# EasyEDA Pro project 工创扩展板.eprj

# Schematic Schematic1
Board Name: Board1; Create Date: 2025-02-10; Page Name: GPIO扩展功能; Project Name: 工创扩展板; Schematic Name: Schematic1; Update Date: 2025-02-24; Company: 嘉立创EDA; Page Size: A4; Version: V1.0
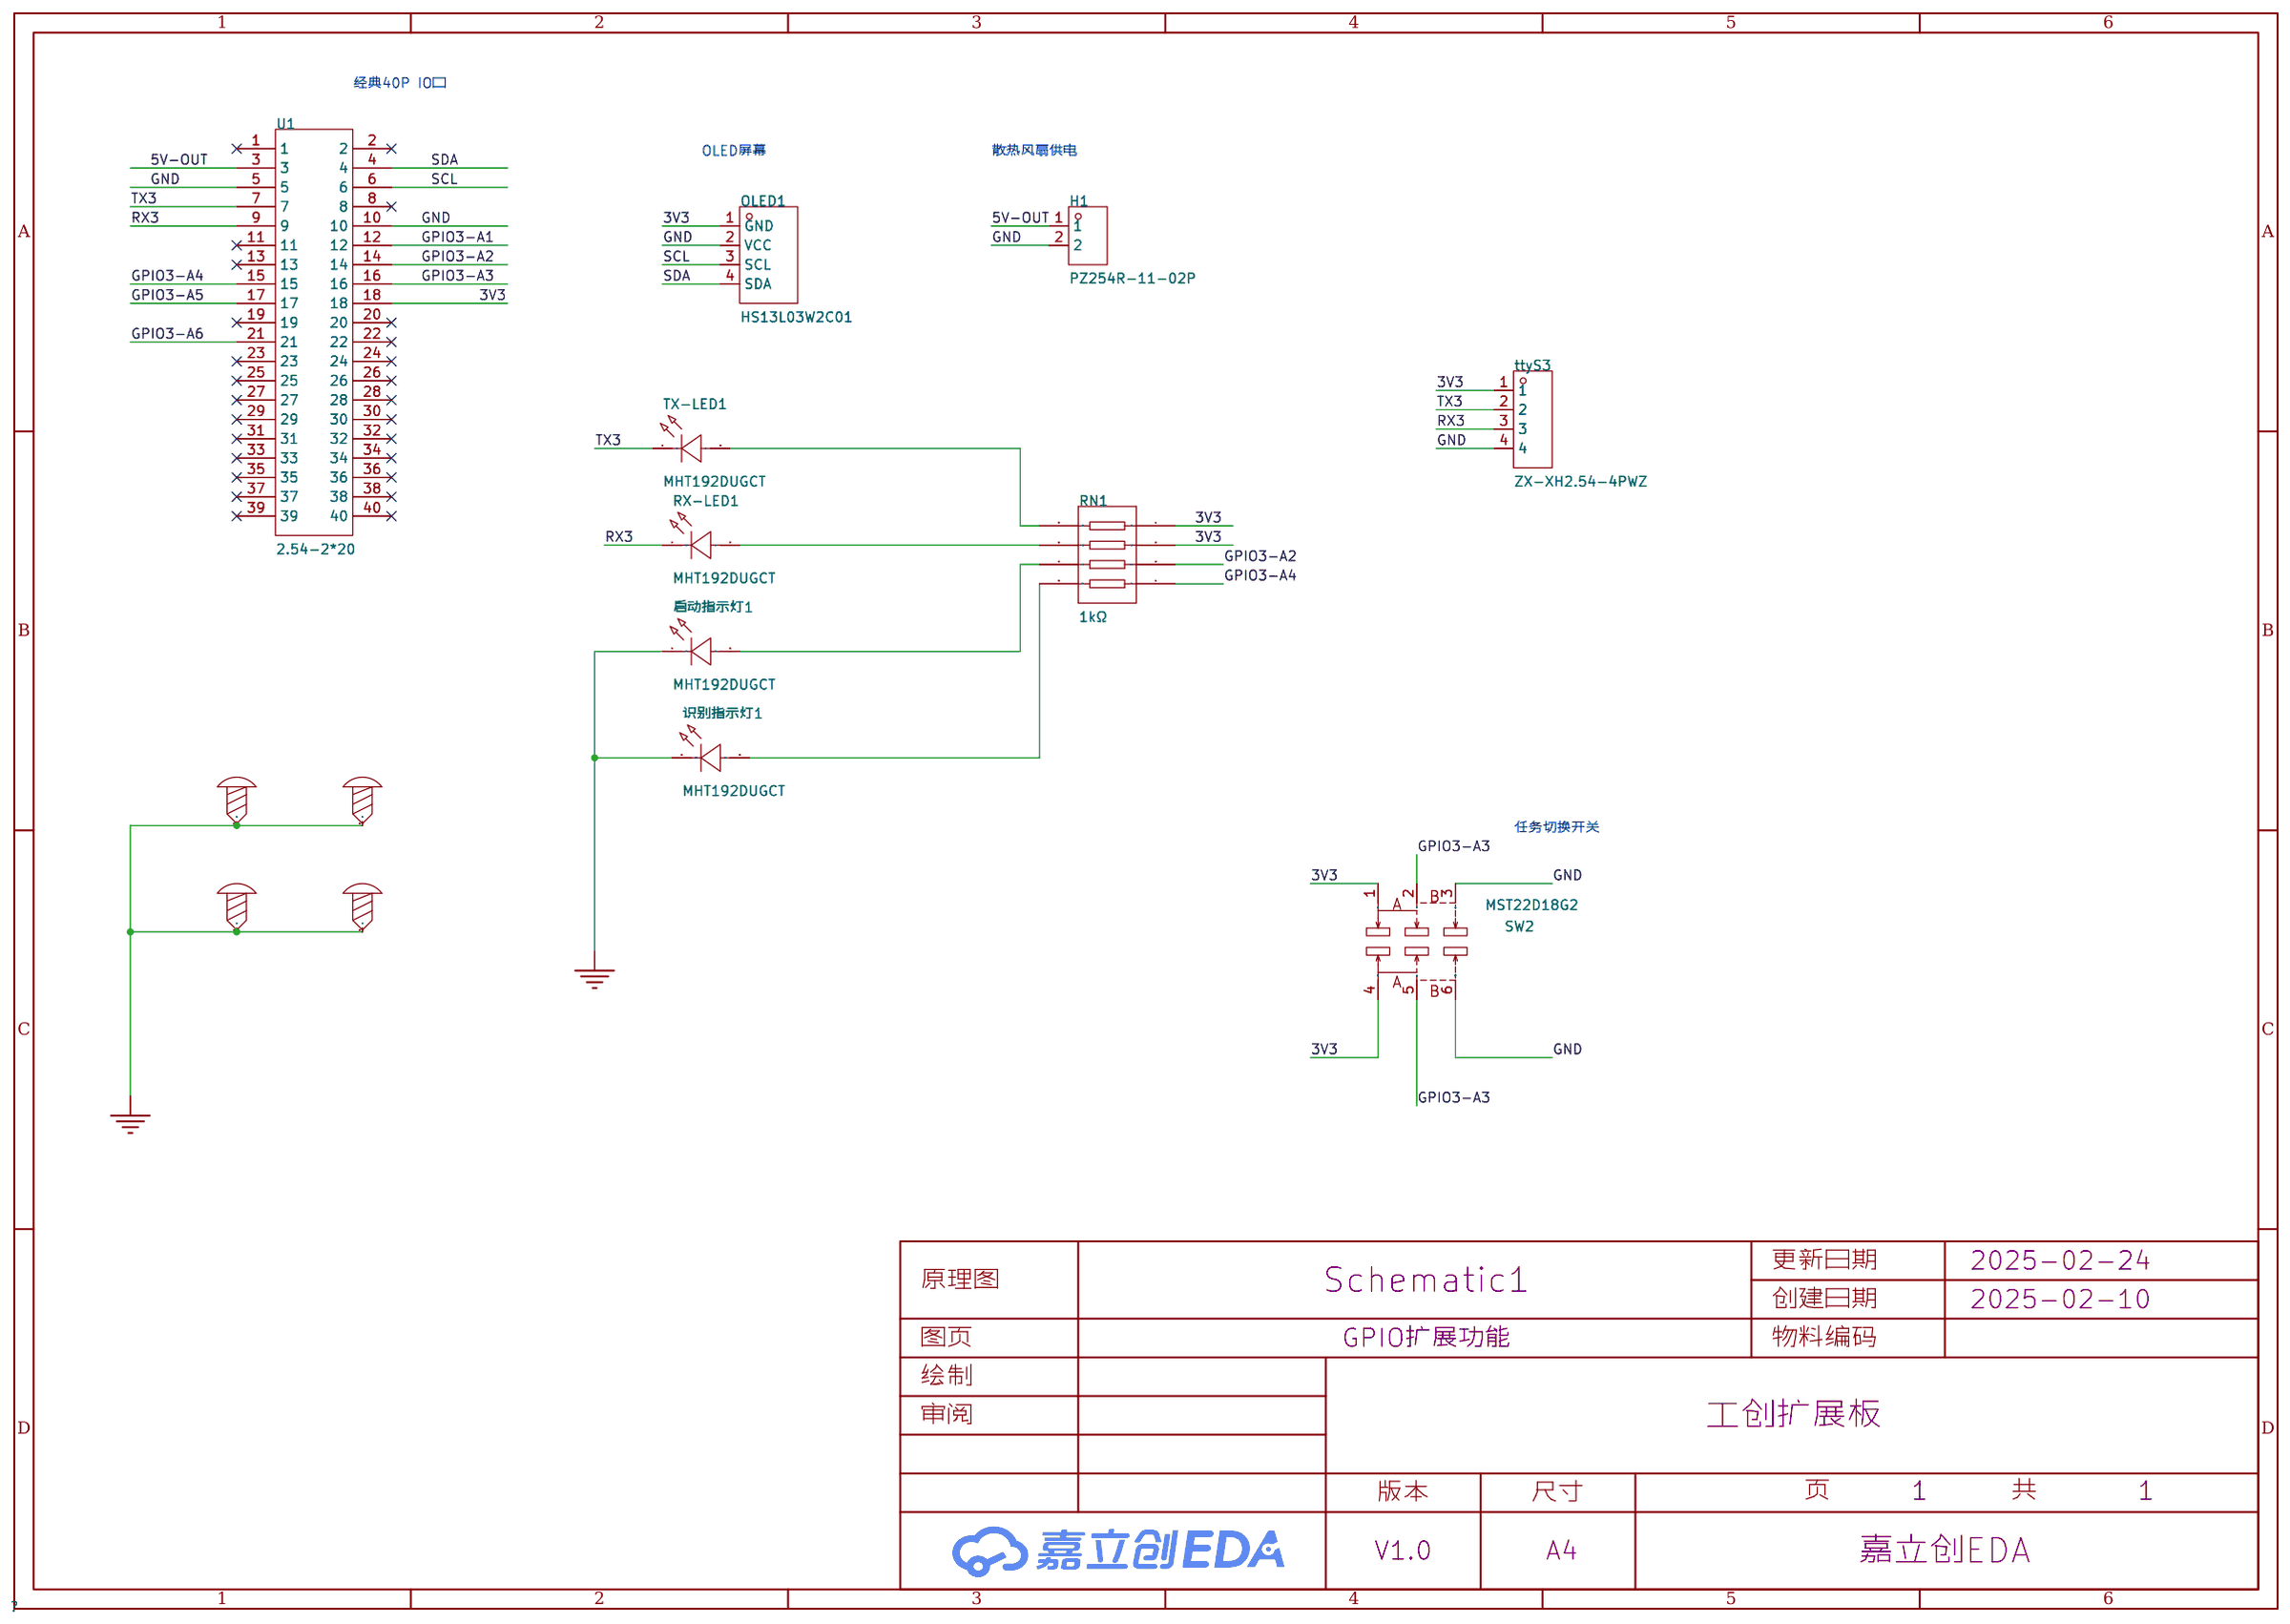
[diagram p0: schematic sheet]

## Parts
H1  PZ254R-11-02P  [HDR-TH_2P-P2.54-H-M-W10.4]
OLED1  HS13L03W2C01  [OLED-TH_L35.4-W33.5_HS13L03W2C01]
RN1  1kΩ  [RES-ARRAY-SMD_0603-8P-L3.2-W1.6-BL]
RX-LED1  MHT192DUGCT  [LED0603-RD]
SCREW1  -  [M3螺丝]
SCREW2  -  [M3螺丝]
SCREW3  -  [M3螺丝]
SCREW4  -  [M3螺丝]
SW2  MST22D18G2  [SW-SMD_MST22D18G2]
ttyS3  ZX-XH2.54-4PWZ  [CONN-TH_4P-P2.50_ZX-XH2.54-4PWZ]
TX-LED1  MHT192DUGCT  [LED0603-RD]
U1  2.54-2*20  [HDR-TH_40P-P2.54-V-F-R2-C20-S2.54]
启动指示灯1  MHT192DUGCT  [LED0603-RD]
识别指示灯1  MHT192DUGCT  [LED0603-RD]

## Library data of the parts
H1 = PZ254R-11-02P: LCSC Part Name: 间距:2.54mm 1x2P 弯插 方针; Supplier Part: C492410; Manufacturer: XFCN(兴飞); Supplier Footprint: 弯插,P=2.54mm; JLCPCB Part Class: 扩展库; Datasheet: https://atta.szlcsc.com/upload/public/pdf/source/20200309/C492410_AD20A982E51A4870F6FD4D2413672598.pdf; Supplier: LCSC; Pin Structure: 1x2P; Pitch: 2.54mm; Circluar Pins/Square Pins: 方针; Mounting Type: 弯插; Number of Rows: 单排; Number of Pins: 2P; Length of Mating Pin: 6mm; Insulation Height: 2.5mm; Contact Material: 黄铜; Operating Temperature Range: -40℃~+105℃; Color: 黑色
OLED1 = HS13L03W2C01: LCSC Part Name: 1.3'1.3寸 128*64 OLED显示屏 I2C通讯 SH1106 白光; Supplier Part: C7465997; Manufacturer: HS(汉昇); JLCPCB Part Class: 扩展库; Datasheet: https://atta.szlcsc.com/upload/public/pdf/source/20230720/8731A47396DED074CDCD72E9ACEFB46F.pdf; Supplier: LCSC; Main Control Chip: SH1106; Interface Type: I2C; Size: 1.3; Operating Temperature: -40℃~+70℃
RN1 = YC164-FR-071KL: LCSC Part Name: 1kΩ ±1%; Supplier Part: C110021; Manufacturer: YAGEO(国巨); Supplier Footprint: 0603x4; JLCPCB Part Class: 扩展库; Datasheet: https://atta.szlcsc.com/upload/public/pdf/source/20170428/1493376791474.pdf; Supplier: LCSC; Number of Resistors: 4; Tolerance: ±1%; Power(Watts): 62.5mW; Temperature Coefficient: ±200ppm/℃; Number of Pins: 8
RX-LED1 TX-LED1 启动指示灯1 识别指示灯1 = MHT192DUGCT: LCSC Part Name: 0603正贴翠绿色光0.6T; Supplier Part: C7470862; Manufacturer: MEIHUA(美华); Supplier Footprint: 0603; JLCPCB Part Class: 扩展库; Datasheet: https://atta.szlcsc.com/upload/public/pdf/source/20231114/40E469906A7C8BE4964C1CB3B5553F65.pdf; Supplier: LCSC; Emitted Color: 翠绿色; Forward Voltage (VF): 2.3V~2.8V; Forward Current: 5mA; Dominant Wavelength: 515nm~530nm; Peak Wavelength: 518nm; Lens Color: 透明透镜; Luminous Intensity: 285mcd~565mcd; Viewing Angle: 120°; Operating Temperature: -40℃~+85℃
SCREW1-SCREW4 = M3螺丝: Supplier Footprint: 插件
SW2 = MST22D18G2: LCSC Part Name: 两档立式贴片 6脚拨动 柄长2.0MM; Supplier Part: C431544; Manufacturer: SHOU HAN(首韩); Supplier Footprint: SMD,3.6x9.1mm; JLCPCB Part Class: 扩展库; Datasheet: https://atta.szlcsc.com/upload/public/pdf/source/20190925/C431544_D32DFFD935A96A6C5145903882D4ABA1.pdf; Supplier: LCSC; Circuit: 双刀双掷; Pin Style: SMD接片; Switch Length: 9.1mm; Switch Width: 3.6mm; Switch Height: 3.45mm; Mounting Style: 立贴; Current Rating (DC): 50mA; Voltage Rating (DC): 12V; Mechanical Life: 1万次; Operating Temperature: -30℃~+80℃
ttyS3 = ZX-XH2.54-4PWZ: LCSC Part Name: 1x4P 间距:2.5mm 弯插 系列:XH; Supplier Part: C7429643; Manufacturer: Megastar(兆星); Supplier Footprint: 弯插,P=2.5mm; JLCPCB Part Class: 扩展库; Datasheet: https://atta.szlcsc.com/upload/public/pdf/source/20230619/8DC602C7BA46C153FF1BE89D90453879.pdf; Supplier: LCSC; Pins Structure: 1x4P; Pitch: 2.5mm; Mounting Type: 弯插; Reference Series: XH; Number of Pins: 4P; Number of Rows: 1; Number of PINs Per Row: 4; Rated Current: 3A; Contact Material: 黄铜; Contact Plating: 锡; Operating Temperature: -25℃~+85℃; Rated Voltage (Max): 250V; Plastic Material: PA66; Flame Retardant Rating: UL94V-0; Color: 白色; Z-Height of the Board: 5.9mm; X-Length of Bottom Edge on Board (Spacing Line): 12.5mm; Y-Width of Bottom Edge on Board: 7.32mm
U1 = 2.54-2*20: LCSC Part Name: 间距:2.54mm 2x20P 直插; Supplier Part: C2977589; Manufacturer: ZHOURI(洲日); Supplier Footprint: 插件,P=2.54mm; JLCPCB Part Class: 扩展库; Datasheet: https://atta.szlcsc.com/upload/public/pdf/source/20220328/834E302BE3C038BBC5C70F5E02589B1E.pdf; Supplier: LCSC; Holes Structure: 2x20P; Pitch: 2.54mm; Row Spacing: 2.54mm; Circular Hole / Square Hole: 方孔; Mounting Type: 直插; Number of Rows: 双排; Number of Holes: 40P; Current Rating (Max): 2.5A; Holes Direction: 顶部; Insulation Height: 8.5mm; Operating Temperature Range: -40℃~+105℃

## Nets
3V3: OLED1.1(GND) RN1.3 RN1.4 SW2.1 SW2.4 ttyS3.1 U1.18
5V-OUT: H1.1 U1.3
GND: H1.2 OLED1.2(VCC) SCREW1.1 SCREW2.1 SCREW3.1 SCREW4.1 SW2.3 SW2.6 ttyS3.4 U1.5 U1.10 启动指示灯1.1(K) 识别指示灯1.1(K)
GPIO3-A1: U1.12
GPIO3-A2: RN1.2 U1.14
GPIO3-A3: SW2.2 SW2.5 U1.16
GPIO3-A4: RN1.1 U1.15
GPIO3-A5: U1.17
GPIO3-A6: U1.21
RX3: RX-LED1.1(K) ttyS3.3 U1.9
SCL: OLED1.3(SCL) U1.6
SDA: OLED1.4(SDA) U1.4
TX3: ttyS3.2 TX-LED1.1(K) U1.7
Net-(RN1-5): RN1.5 TX-LED1.2(A)
Net-(RN1-6): RN1.6 RX-LED1.2(A)
Net-(RN1-7): RN1.7 启动指示灯1.2(A)
Net-(RN1-8): RN1.8 识别指示灯1.2(A)

Not connected (* = marked no-connect by the designer): U1 1* 2* 8* 11* 13* 19* 20* 22* 23* 24* 25* 26* 27* 28* 29* 30* 31* 32* 33* 34* 35* 36* 37* 38* 39* 40*

## Notes on the sheet
- 经典40P IO口
- OLED屏幕
- 散热风扇供电
- 任务切换开关

# Board PCB1
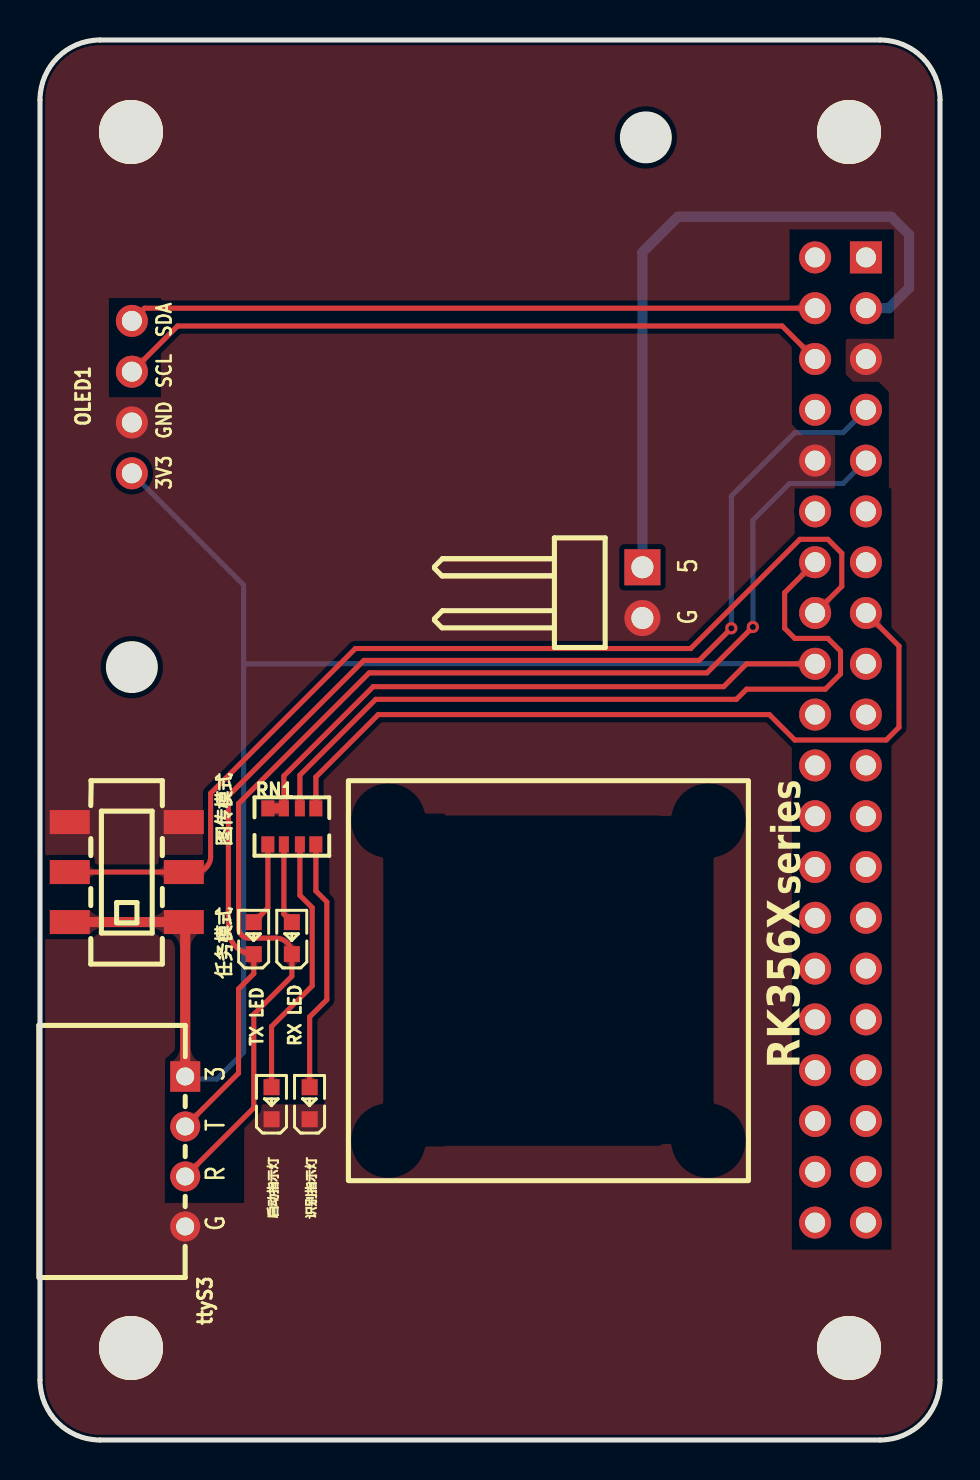
[diagram p1: board, top side]
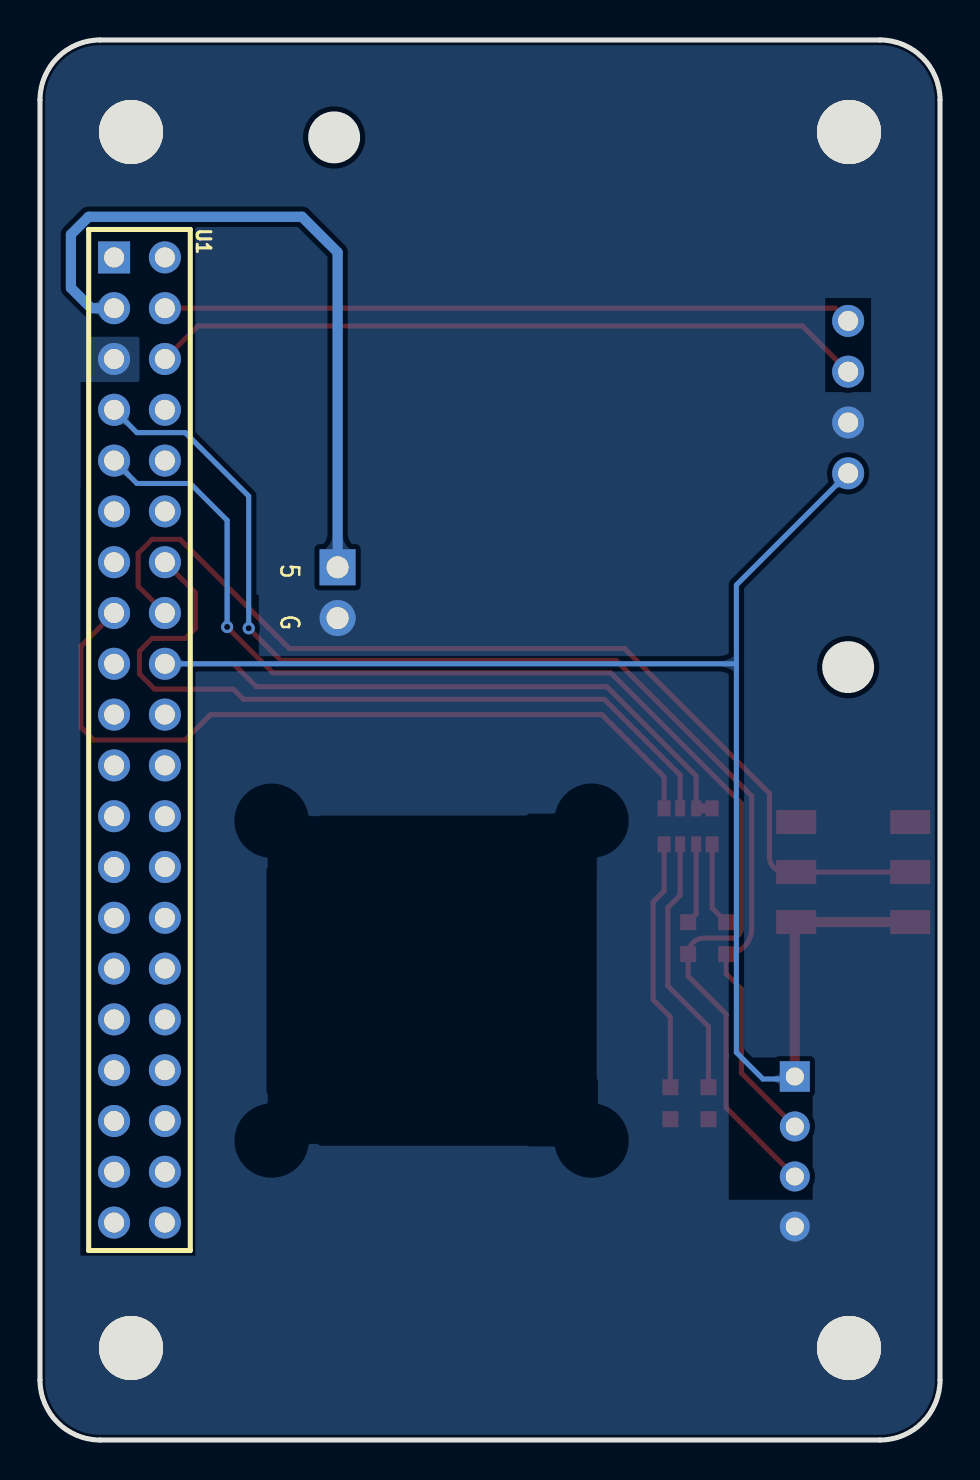
[diagram p2: board, bottom side, seen from below]

Outline 45 x 70 mm; copper layers: Top Layer, Bottom Layer. Coordinates in mm from the lower left corner of the outline.
Outline path: 0,67 0,3 arc(0.88,0.88) 3,0 42,0 arc(44.12,0.88) 45,3 45,67 arc(44.12,69.12) 42,70 3,70 arc(0.88,69.12) 0,67
Stack: Top Layer 0.035mm / Dielectric1 1.51mm FR4 er 4.5 / Bottom Layer 0.035mm

## Design rules (mm)
template: 自定义配置
spacing copperThickness1oz (default): track to track 0.102, other pairs 0.152 to 0.3
spacing copperThickness2oz: track to track 0.203, other pairs 0.152 to 0.3
track width copperThickness1oz (default): min 0.127, default 0.254, max 2.54
track width copperThickness2oz: min 0.203, default 0.254, max 2.54
differential pair differentialPair (default): width min 0.127, default 0.254, max 2.54; gap min 0.152, default 0.152
via viaSize (default): diameter min 0.5, default 0.61, max 10; hole min 0.3, default 0.305, max 6.3

## Placement (name value [footprint] x y rotation side)
H1  PZ254R-11-02P  [HDR-TH_2P-P2.54-H-M-W10.4]  30.12 42.37 270 top
OLED1  HS13L03W2C01  [OLED-TH_L35.4-W33.5_HS13L03W2C01]  4.59 52.14 90 top
RN1  1kΩ  [RES-ARRAY-SMD_0603-8P-L3.2-W1.6-BL]  12.59 30.68 180 top
RX LED  MHT192DUGCT  [LED0603-RD]  12.59 25.09 90 top
SCREW1  -  [M3螺丝]  4.55 65.4 0 top
SCREW2  -  [M3螺丝]  4.55 4.6 0 top
SCREW3  -  [M3螺丝]  40.45 65.4 0 top
SCREW4  -  [M3螺丝]  40.45 4.6 0 top
SW2  MST22D18G2  [SW-SMD_MST22D18G2]  4.34 28.4 90 top
ttyS3  ZX-XH2.54-4PWZ  [CONN-TH_4P-P2.50_ZX-XH2.54-4PWZ]  7.26 14.43 270 top
TX LED  MHT192DUGCT  [LED0603-RD]  10.69 25.09 90 top
U1  2.54-2*20  [HDR-TH_40P-P2.54-V-F-R2-C20-S2.54]  40.03 35 270 bottom
启动指示灯  MHT192DUGCT  [LED0603-RD]  11.58 16.84 90 top
识别指示灯  MHT192DUGCT  [LED0603-RD]  13.48 16.84 90 top

## Footprints (pads in the part's own frame, mm; a bottom-side part is the same pattern mirrored in y, then rotated)
CONN-TH_4P-P2.50_ZX-XH2.54-4PWZ
  rect 1.524x1.5 hole 0.9: 1(-3.75,0)
  round 1.5 hole 0.9: 2(-1.25,0) 3(1.25,0) 4(3.75,0)
HDR-TH_2P-P2.54-H-M-W10.4
  rect 1.8x1.8 hole 1.1: 1(-1.27,0)
  round 1.8 hole 1.1: 2(1.27,0)
HDR-TH_40P-P2.54-V-F-R2-C20-S2.54
  rect 1.6x1.6 hole 1: 1(-24.13,-1.27)
  round 1.6 hole 1: 2(-24.13,1.27) 3(-21.59,-1.27) 4(-21.59,1.27) 5(-19.05,-1.27) 6(-19.05,1.27) 7(-16.51,-1.27) 8(-16.51,1.27) 9(-13.97,-1.27) 10(-13.97,1.27) 11(-11.43,-1.27) 12(-11.43,1.27) 13(-8.89,-1.27) 14(-8.89,1.27) 15(-6.35,-1.27) 16(-6.35,1.27) 17(-3.81,-1.27) 18(-3.81,1.27) 19(-1.27,-1.27) 20(-1.27,1.27) 21(1.27,-1.27) 22(1.27,1.27) 23(3.81,-1.27) 24(3.81,1.27) 25(6.35,-1.27) 26(6.35,1.27) 27(8.89,-1.27) 28(8.89,1.27) 29(11.43,-1.27) 30(11.43,1.27) 31(13.97,-1.27) 32(13.97,1.27) 33(16.51,-1.27) 34(16.51,1.27) 35(19.05,-1.27) 36(19.05,1.27) 37(21.59,-1.27) 38(21.59,1.27) 39(24.13,-1.27) 40(24.13,1.27)
LED0603-RD
  rect 0.8x0.8 smd: 1(-0.799,0) 2(0.799,0)
M3螺丝
  round 3.2 hole 3.2: 1(0,0)
OLED-TH_L35.4-W33.5_HS13L03W2C01
  round 1.6 hole 1: 1(-3.81,0) 2(-1.27,0) 3(1.27,0) 4(3.81,0)
RES-ARRAY-SMD_0603-8P-L3.2-W1.6-BL
  rect 0.65x0.8 smd: 1(-1.2,-0.9) 4(1.2,-0.9) 5(1.2,0.9) 8(-1.2,0.9)
  rect 0.5x0.8 smd: 2(-0.4,-0.9) 3(0.4,-0.9) 6(0.4,0.9) 7(-0.4,0.9)
SW-SMD_MST22D18G2
  rect 1.2x2 smd: 1(-2.5,2.85) 2(0,2.85) 3(2.5,2.85) 4(-2.5,-2.85) 5(0,-2.85) 6(2.5,-2.85)

## Nets
3V3: OLED1.1 RN1.3 RN1.4 SW2.1 SW2.4 ttyS3.1 U1.18
5V-OUT: H1.1 U1.3
GND: H1.2 OLED1.2 SCREW1.1 SCREW2.1 SCREW3.1 SCREW4.1 SW2.3 SW2.6 ttyS3.4 U1.5 U1.10 启动指示灯.1 识别指示灯.1
GPIO3-A1: U1.12
GPIO3-A2: RN1.2 U1.14
GPIO3-A3: SW2.2 SW2.5 U1.16
GPIO3-A4: RN1.1 U1.15
GPIO3-A5: U1.17
GPIO3-A6: U1.21
RX3: RX LED.1 ttyS3.3 U1.9
SCL: OLED1.3 U1.6
SDA: OLED1.4 U1.4
TX3: ttyS3.2 TX LED.1 U1.7
$1N5290: RN1.6 RX LED.2
$1N5297: RN1.5 TX LED.2
$1N5378: RN1.8 识别指示灯.2
$1N5379: RN1.7 启动指示灯.2

Pads without a net: U1 1 2 8 11 13 19 20 22 23 24 25 26 27 28 29 30 31 32 33 34 35 36 37 38 39 40

## Via types
v1: diameter 0.61, hole 0.305, Top Layer to Bottom Layer, 2 vias

## Routing (per net, layer and track width the routed paths; a pad name or vN(x,y) marks a point on that pad's centre or on a via; arc(x,y) is an arc through that point)
3V3: length 108.1
  Top Layer w0.254: U1.18 35.33,38.81 34.18,37.67 16.66,37.67 12.19,33.2 RN1.3
  Top Layer w0.508: ttyS3.1 7.26,25.83 SW2.4 SW2.1 ; RN1.4 RN1.3
  Bottom Layer w0.254: ttyS3.1 7.39,18.05 8.85,18.05 10.18,19.38 10.18,42.75 OLED1.1 ; U1.18 10.18,38.81
5V-OUT: length 35.4
  Bottom Layer w0.508: H1.1 30.12,59.38 31.9,61.16 42.57,61.16 43.46,60.27 43.46,57.61 42.44,56.59 U1.3
GPIO3-A2: length 39.1
  Top Layer w0.254: U1.14 37.23,42.37 37.23,40.59 37.74,40.08 39.39,40.08 40.03,39.44 40.03,38.3 39.26,37.54 35.33,37.54 34.82,37.03 16.78,37.03 12.99,33.24 RN1.2
GPIO3-A3: length 51.3
  Top Layer w0.254: SW2.2 SW2.5 7.77,28.4 arc(8.31,28.62) 8.53,29.16 8.53,32.33 15.77,39.57 32.53,39.57 37.99,45.03 39.39,45.03 40.09,44.34 40.09,42.68 U1.16
GPIO3-A4: length 39.2
  Top Layer w0.254: RN1.1 13.79,33.15 16.91,36.27 36.47,36.27 37.74,35 42.31,35 42.95,35.64 42.95,39.7 U1.15
RX3: length 64.6
  Top Layer w0.254: ttyS3.3 10.69,16.6 10.69,21.28 12.59,23.19 RX LED.1 arc(12.36,24.86) 11.79,25.09 10.44,25.09 arc(10.08,25.24) 9.93,25.6 9.93,31.83 16.46,38.36 33.35,38.36 v1(35.64,40.65)
  Bottom Layer w0.254: v1(35.64,40.65) 35.64,45.99 37.49,47.83 40.15,47.83 U1.9
SCL: length 35.8
  Top Layer w0.254: U1.6 37.1,55.7 6.88,55.7 4.59,53.42
SDA: length 34.4
  Top Layer w0.254: U1.4 5.23,56.59 OLED1.4
TX3: length 62.4
  Top Layer w0.254: v1(34.56,40.59) 32.96,38.98 16.19,38.98 9.42,32.21 9.42,25.56 arc(9.79,24.67) TX LED.1 10.69,23.32 9.93,22.55 9.93,18.34 ttyS3.2
  Bottom Layer w0.254: v1(34.56,40.59) 34.56,47.19 37.74,50.37 40.15,50.37 U1.7
$1N5290: length 4.1
  Top Layer w0.254: RX LED.2 12.19,26.29 RN1.6
$1N5297: length 4.2
  Top Layer w0.254: RN1.5 11.39,26.6 TX LED.2
$1N5378: length 12.7
  Top Layer w0.254: RN1.8 13.79,27.45 14.34,26.9 14.34,22.02 13.48,21.16 识别指示灯.2
$1N5379: length 13.2
  Top Layer w0.254: 启动指示灯.2 11.58,20.68 13.61,22.71 13.61,26.62 12.99,27.23 RN1.7

## Copper pours and planes (outline as drawn; the poured copper is in the pictures)
GND on Top Layer: -4.17,73.1 45.87,73.1 45.87,-1.32 -4.17,-1.32
GND on Bottom Layer: -2.27,70.94 48.66,70.94 48.66,-4.5 -2.27,-4.5

Small or netless copper shapes (teardrops, artwork), in the pictures only: 36 on Top Layer, 10 on Bottom Layer

## Text on the board
Bottom Silkscreen Layer: 5 | G
Top Solder Mask Layer: GDOU | AnAn | IVEN | Full Stack Engineer | Visual Engineer
Top Silkscreen Layer: SDA | SCL | GND | 3V3 | 3 | T | R | G | 5 | RK356X | series | 任务模式 | 图传模式
